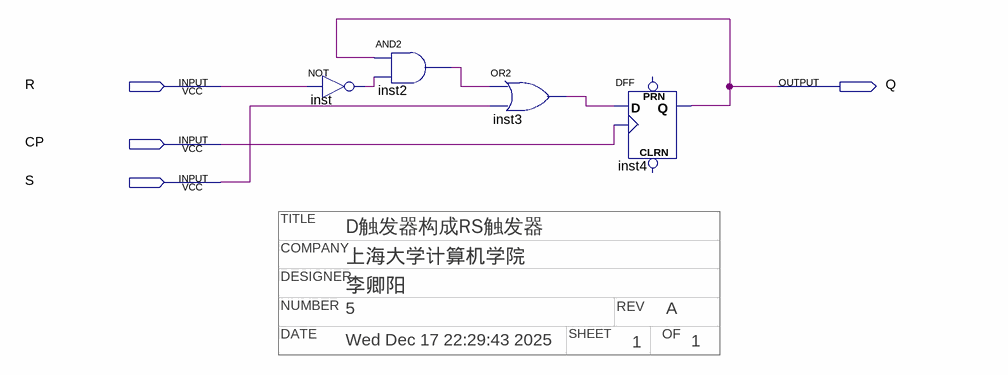
[diagram p0: schematic sheet]
// Quartus schematic sikao1.bdf as structural Verilog: 4 symbols, 4 pins
// Title block: TITLE: D触发器构成RS触发器; COMPANY: 上海大学计算机学院; DESIGNER: 李卿阳; NUMBER: 5; REV: A; DATE: Wed Dec 17 22:29:43 2025; SHEET: 1; OF: 1
module sikao1 (
  input  R,
  input  CP,
  input  S,
  output Q
);

  wire inst2_out, inst3_out, inst_out;

  not inst (inst_out, R);
  and inst2 (inst2_out, Q, inst_out);
  or inst3 (inst3_out, inst2_out, S);
  DFF inst4 (.CLK(CP), .D(inst3_out), .Q(Q));  // open: CLRN, PRN
endmodule
